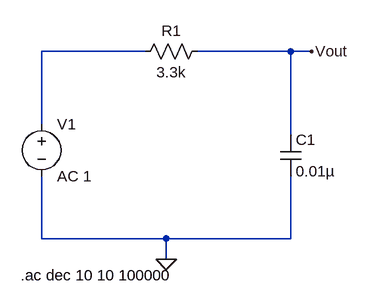
[diagram p0: schematic lpFO.asc]
lpFO.asc, the LTspice schematic file:
Version 4
SHEET 1 880 680
WIRE 288 -16 128 -16
WIRE 512 -16 368 -16
WIRE 544 -16 512 -16
WIRE 128 96 128 -16
WIRE 512 112 512 -16
WIRE 128 272 128 176
WIRE 320 272 128 272
WIRE 512 272 512 176
WIRE 512 272 320 272
WIRE 320 304 320 272
FLAG 320 304 0
FLAG 544 -16 Vout
SYMBOL voltage 128 80 R0
WINDOW 123 0 0 Left 0
WINDOW 39 0 0 Left 0
SYMATTR InstName V1
SYMATTR Value AC 1
SYMBOL res 384 -32 R90
WINDOW 0 0 56 VBottom 2
WINDOW 3 32 56 VTop 2
SYMATTR InstName R1
SYMATTR Value 3.3k
SYMBOL cap 496 112 R0
SYMATTR InstName C1
SYMATTR Value 0.01µ
TEXT 96 328 Left 2 !.ac dec 10 10 100000

The netlist it stands for:
* lpFO.asc
V1 N001 0 AC 1
R1 Vout N001 3.3k
C1 Vout 0 0.01µ
.ac dec 10 10 100000
.backanno
.end

* Results of the author's LTspice run, read from the files saved beside the schematic
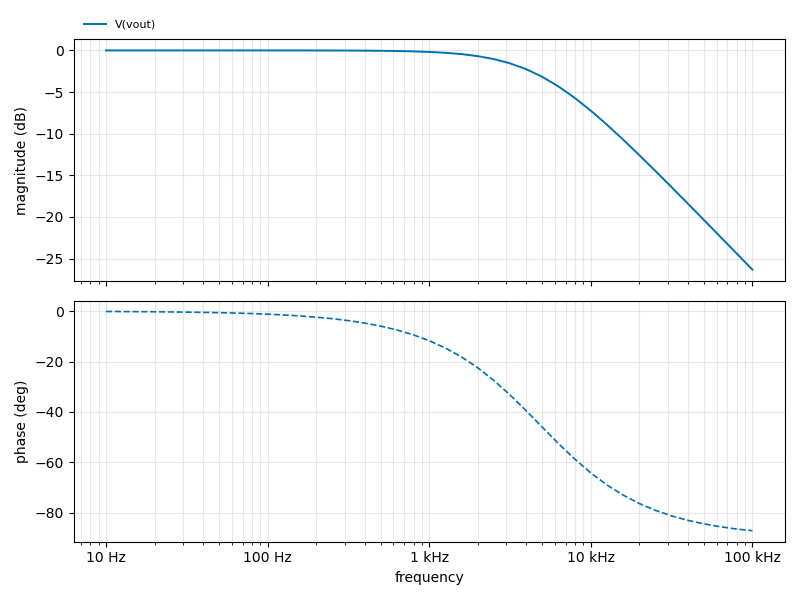
[diagram p1: AC Analysis of lpFO.asc, plotted from the saved traces]
* AC Analysis, 1 run:
*   V(vout): -0.00 dB at 10 Hz, -26.34 dB at 100 kHz, peak -0.00 dB at 10 Hz, 3 dB below the peak at 4.804 kHz